# EAGLE design OpenLog (EAGLE 9.1.0)
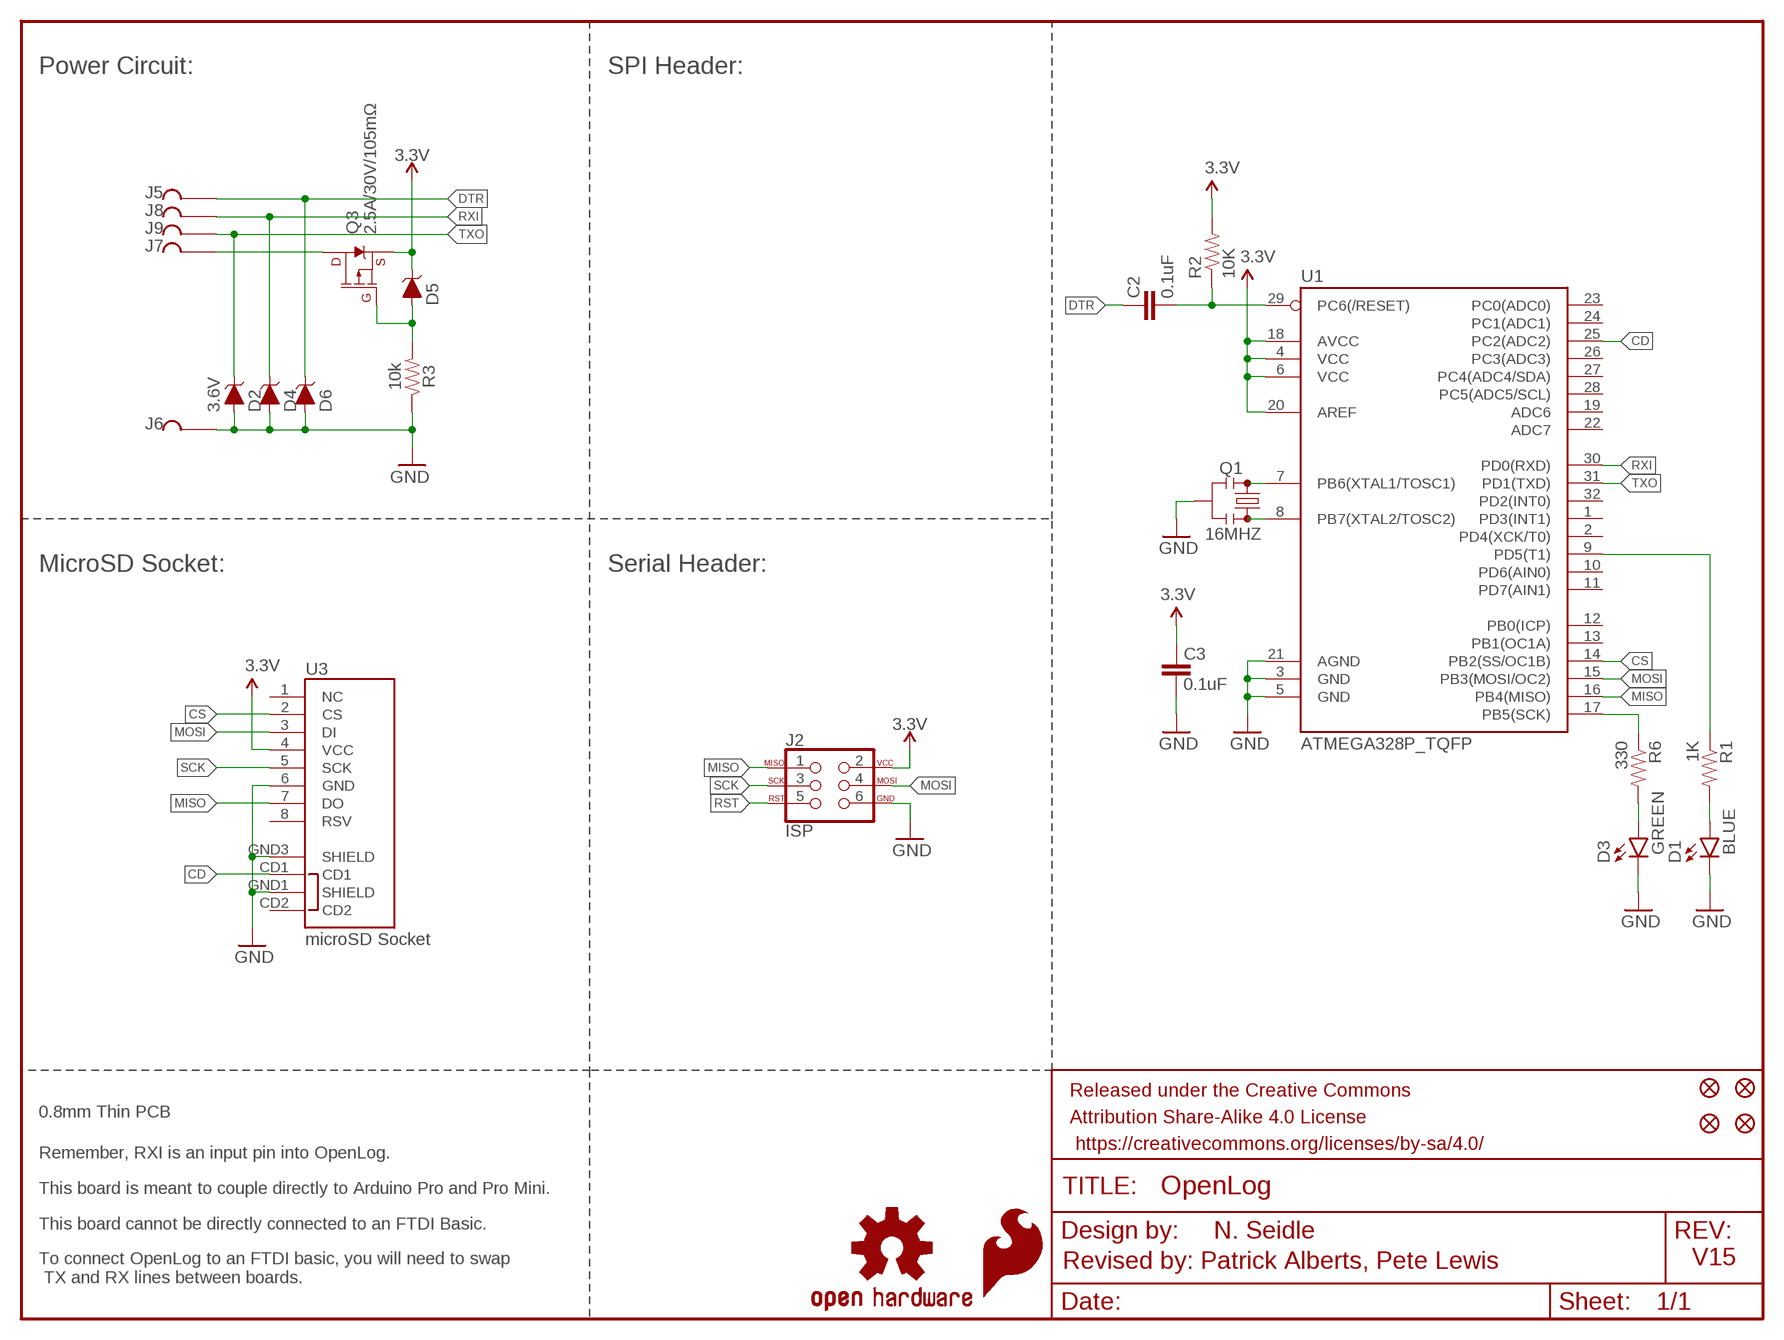
[diagram p0: schematic, sheet 1]

## Parts
C2  0.1uF  0.1UF-25V(+80/-20%)(0603)  [0603-CAP]
C3  0.1uF  0.1UF-25V(+80/-20%)(0603)  [0603-CAP]
D1  BLUE  LED-BLUE0603  [LED-0603]
D2  3.6V  DIODE-ZENER-BZT52C3V6S  [SOD-323]
D3  GREEN  LED-GREEN0603  [LED-0603]
D4  3.6V  DIODE-ZENER-BZT52C3V6S  [SOD-323]
D5  3.6V  DIODE-ZENER-BZT52C3V6S  [SOD-323]
D6  3.6V  DIODE-ZENER-BZT52C3V6S  [SOD-323]
FID1  FIDUCIALUFIDUCIAL  [FIDUCIAL-MICRO]
FID2  FIDUCIALUFIDUCIAL  [FIDUCIAL-MICRO]
FID3  FIDUCIALUFIDUCIAL  [FIDUCIAL-MICRO]
FID4  FIDUCIALUFIDUCIAL  [FIDUCIAL-MICRO]
FRAME1  FRAME-LETTER  [CREATIVE_COMMONS]
J2  ISP  AVR_SPI_PROG_3X2TESTPOINTS  [2X3_TEST_POINTS]
J5  GATORGATOR_MINI  [GATOR_MINI]
J6  GATORGATOR_MINI  [GATOR_MINI]
J7  GATORGATOR_MINI  [GATOR_MINI]
J8  GATORGATOR_MINI  [GATOR_MINI]
J9  GATORGATOR_MINI  [GATOR_MINI]
LOGO1  SFE_LOGO_FLAME.1_INCH  [SFE_LOGO_FLAME_.1]
LOGO2  OSHW-LOGOMINI  [OSHW-LOGO-MINI]
Q1  16MHZ  RESONATOR16MHZ  [RESONATOR-SMD]
Q3  2.5A/30V/105mΩ  MOSFET_PCH-DMG2307L  [SOT23-3]
R1  1K  1KOHM-1/10W-1%(0603)  [0603-RES]
R2  10K  10KOHM-1/10W-1%(0603)0603  [0603-RES]
R3  10k  10KOHM-0603-1/10W-1%  [0603]
R6  330  330OHM1/10W1%(0603)  [0603-RES]
U1  ATMEGA328P_TQFP  [TQFP32-08]
U3  microSD Socket  USD-SOCKET  [MICROSD_1:1]

## Nets
3.3V: C3.2 D5.C J2.2 Q3.2(S) R2.2 U1.4(VCC) U1.6(VCC) U1.18(AVCC) U1.20(AREF) U3.4(VCC)
CD: U1.25(PC2(ADC2)) U3.CD1
CS: U1.14(PB2(SS/OC1B)) U3.2(CS)
DTR: C2.2 D6.C J5.P$2
GND [vcc]: C3.1 D1.C D2.A D3.C D4.A D6.A J2.6 J6.P$2 Q1.2 R3.1 U1.3(GND) U1.5(GND) U1.21(AGND) U3.6(GND) U3.GND1(SHIELD) U3.GND3(SHIELD)
MISO: J2.1 U1.16(PB4(MISO)) U3.7(DO)
MOSI: J2.4 U1.15(PB3(MOSI/OC2)) U3.3(DI)
N$1: Q1.1 U1.8(PB7(XTAL2/TOSC2))
N$2: Q1.3 U1.7(PB6(XTAL1/TOSC1))
N$3: D1.A R1.2
N$4: R1.1 U1.9(PD5(T1))
N$5 [vcc]: D5.A Q3.1(G) R3.2
N$6: J7.P$2 Q3.3(D)
N$7: D3.A R6.2
RST: C2.1 J2.5 R2.1 U1.29(PC6(/RESET))
RXI: D4.C J8.P$2 U1.30(PD0(RXD))
SCK: J2.3 R6.1 U1.17(PB5(SCK)) U3.5(SCK)
TXO: D2.C J9.P$2 U1.31(PD1(TXD))
Unconnected: U1.1(PD3(INT1)) U1.2(PD4(XCK/T0)) U1.10(PD6(AIN0)) U1.11(PD7(AIN1)) U1.12(PB0(ICP)) U1.13(PB1(OC1A)) U1.19(ADC6) U1.22(ADC7) U1.23(PC0(ADC0)) U1.24(PC1(ADC1)) U1.26(PC3(ADC3)) U1.27(PC4(ADC4/SDA)) U1.28(PC5(ADC5/SCL)) U1.32(PD2(INT0)) U3.1(NC) U3.8(RSV) U3.CD2

## Notes on the sheet
- Power Circuit: | SPI Header:
- MicroSD Socket: | Serial Header:
- 0.8mm Thin PCB
- Remember, RXI is an input pin into OpenLog.
- This board is meant to couple directly to Arduino Pro and Pro Mini.
- This board cannot be directly connected to an FTDI Basic.
- N. Seidle
- Revised by: Patrick Alberts, Pete Lewis | V15
- To connect OpenLog to an FTDI basic, you will need to swap
   TX and RX lines between boards.

## Library data of the parts
C2 C3 = SparkFun-Capacitors:0.1UF-25V(+80/-20%)(0603): CAP-00810 Ceramic Standard decoupling cap; PROD_ID: CAP-00810
D1 = SparkFun-LED:LED-BLUE: Blue SMD LED Used in manufacturing of various products at SparkFun Packages: 0603 - SMD 0603 package [Product Link] <http://www.digikey.com/product-detail/en/SMLE12BC7TT86/511-1589-2-ND/1641808> 1206 - SMD1206 package [Product Link] <http://www.digikey.com/product-detail/en/lite-on-inc/LTST-C150TBKT/160-1643-1-ND/573584> SparkFun Products: ESP8266 Thing-Dev Board <https://www.sparkfun.com/products/13711> RedBoard <https://www.sparkfun.com/products/12757>; PROD_ID: DIO-08575
D2 D4-D6 = SparkFun-DiscreteSemi:DIODE-ZENER: Zener Diode A Zener diode allows current to flow from its anode to its cathode like a normal semiconductor diode, but it also permits current to flow in the reverse direction when its "Zener voltage" is reached. - WIkipedia; PROD_ID: DIO-08199
D3 = SparkFun-LED:LED-GREEN: Green SMD LED Used in manufacturing of various products at SparkFun Packages: 0603 - SMD 0603 package [Product Link] <http://www.futureelectronics.com/en/technologies/semiconductors/optoelectronics/leds/Pages/9894312-LTST-C190GKT.aspx?CrossPart=HSMG-C190&IM=0> LilyPad 1206 - SMD1206 LilyPad package [Product Link] <http://www.futureelectronics.com/en/Technologies/Product.aspx?ProductID=IN150NGHARVATEKCORPORATION2049943&IM=0> 1206 - SMD1206 package [Product Link] <http://www.futureelectronics.com/en/technologies/semiconductors/optoelectronics/leds/Pages/8315665-LTST-C150KGKT.aspx?IM=0> 1206 Bottom Mount -SMD 1206 Bottom Mount [Product Link] <http://www.digikey.com/product-detail/en/lite-on-inc/LTST-C230KGKT/160-1456-1-ND/386854> SparkFun Products: Pro Mini 328 -5V <https://www.sparkfun.com/products/821> RedBoard <https://www.sparkfun.com/products/12757> MP3 Trigger <https://www.sparkfun.com/products/13720> Makey Makey <https://www.sparkfun.com/products/11076>; PROD_ID: DIO-00821
FID1-FID4 = SparkFun-Aesthetics:FIDUCIAL: Fiducial Alignment Points Point-of-reference for pick-and-place machines and other optical instruments.
FRAME1 = SparkFun-Aesthetics:FRAME-LETTER: Schematic Frame - Letter Standard 8.5x11 US Letter frame
J2 = SparkFun-Connectors:AVR_SPI_PROG_3X2: AVR ISP 6 Pin This is the reduced ISP connector for AVR programming. Common on Arduino. This footprint will take up less PCB space and can be used with a 10-pin to 6-pin adapter such as SKU: BOB-08508 **Special note about "TEST_POINT" package. The stop mask is on the top side, so if you want your programming test points to be on the bottom of your board, make sure to place this package on the bottom side of the board. This also ensure that the orientation to program from the bottom side will be correct. SparkFun Products: SparkFun ISP Pogo Adapter <https://www.sparkfun.com/products/11591> - NS Tiny AVR Programmer <https://www.sparkfun.com/products/11801> -PTH
J5-J9 = SparkFun-Connectors:GATOR
LOGO1 = SparkFun-Aesthetics:SFE_LOGO_FLAME: SparkFun Flame Logo This is the SparkFun flame logo. The logo on the schematic will always be the same size; the package variant is the height of the flame. Default layer for the logo on the board is tSilk.
LOGO2 = SparkFun-Aesthetics:OSHW-LOGO: Open-Source Hardware (OSHW) Logo This logo indicates the piece of hardware it is found on incorporates a OSHW license and/or adheres to the definition of open source hardware found here: http://freedomdefined.org/OSHW
Q1 = SparkFun-FreqCtrl:RESONATOR: Resonator Small SMD resonator. Used, eg, on the Arduino Pro/ Pro Mini boards. 8MHz- XTAL-08895 16MHz- XTAL-08900; PROD_ID: XTAL-08900
Q3 = SparkFun-DiscreteSemi:MOSFET_PCH: P-channel MOSFETs Voltage controlled devices that allow control of high current outputs. SparkFun Products: SparkFun ESP32 Thing <https://www.sparkfun.com/products/13907> SparkFun ESP8266 Thing <https://www.sparkfun.com/products/13231> SparkFun Pi Servo HAT V2 <https://www.sparkfun.com/products/15316> DMG2305UX-7 (20V/4.2A/SOT23-3); PROD_ID: TRANS-11308
R1 = SparkFun-Resistors:1KOHM-1/10W-1%(0603): RES-07856; PROD_ID: RES-07856
R2 = SparkFun-Resistors:10KOHM-1/10W-1%(0603): RES-00824; PROD_ID: RES-00824
R3 = SparkFun-Resistors:10KOHM: 10kΩ resistor A resistor is a passive two-terminal electrical component that implements electrical resistance as a circuit element. Resistors act to reduce current flow, and, at the same time, act to lower voltage levels within circuits. - Wikipedia; PROD_ID: RES-00824
R6 = SparkFun-Resistors:330OHM1/10W1%(0603): RES-00818; PROD_ID: RES-00818
U1 = SparkFun-DigitalIC:ATMEGA328P_TQFP; PROD_ID: IC-09069
U3 = SparkFun-Connectors:USD-SOCKET: microSD Socket Push-push type uSD socket. Schematic element and footprint production proven. Spark Fun Electronics SKU : PRT-00127. tDoc lines correctly indicate media card edge positions when inserting (unlocked, locked, depressed). NOTE: CD1 and CD2 are connected internally; PROD_ID: CONN-07820

## Net classes
0 default: width 0.178 mm
1 vcc: width 0.203 mm

## Board
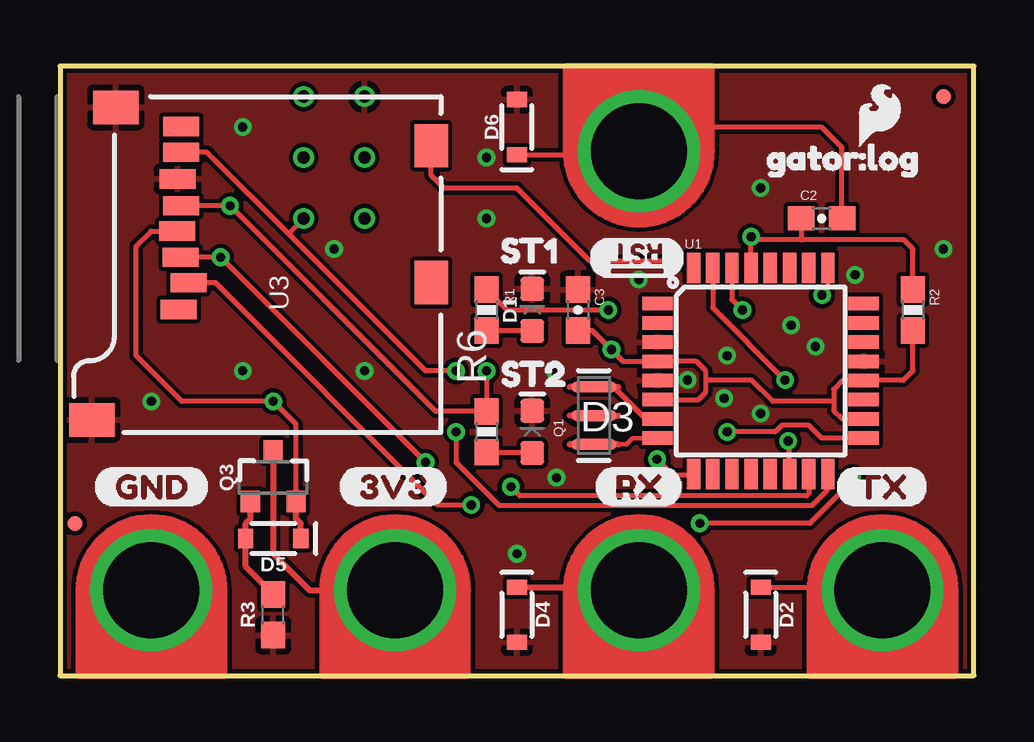
[diagram p1: board, top side]
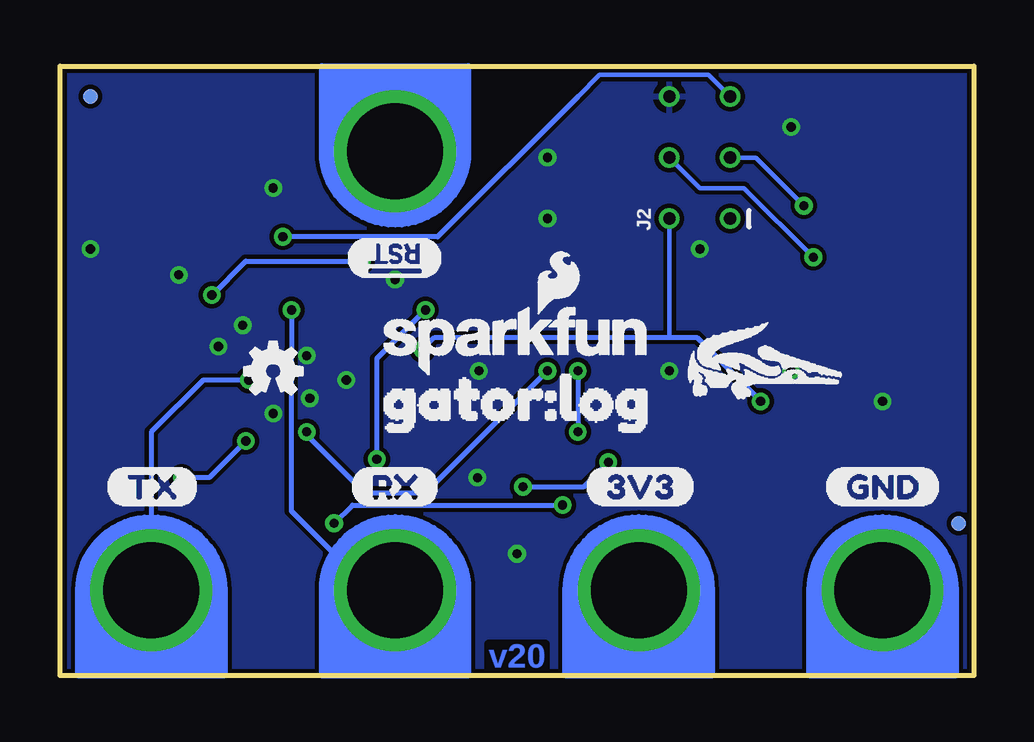
[diagram p2: board, bottom side, seen from below]

Size 38.1 x 25.4 mm. Coordinates in mm from the lower left corner, seen from the top.
Outline: 0,0 38.1,0 38.1,25.4 0,25.4 0,0
Copper layers (1*16): Top 0.035mm / dielectric 1.5mm / Bottom 0.035mm
Design rules "SparkFun-2-layer-TIGHT": minimum track width 7mil, minimum drill 15mil, track to track 7mil, track to pad 7mil, pad to pad 7mil, via to via 7mil, smd to smd 7mil, copper to edge 7mil, drill to drill 7mil, minimum pad ring 7mil, minimum via ring 7mil, stop-mask expansion 4mil, vias tented up to drill 20mil, thermal gap 10mil

### Footprints (pad centres in the part's own frame; a part is rotated, then mirrored left to right if it is on the bottom)
0603-CAP = smd 1.1 x 1: 1 -0.85,0; 2 0.85,0
LED-0603 = smd 1 x 1: A -0.877,0; C 0.877,0
SOD-323 = smd 0.63 x 0.83: A 1.15,0; C -1.15,0
FIDUCIAL-MICRO = smd 0.635 x 0.635: 1 0,0
2X3_TEST_POINTS = drill 0.508: 1 -2.54,-1.27; 2 -2.54,1.27; 3 0,-1.27; 4 0,1.27; 5 2.54,-1.27; 6 2.54,1.27
GATOR_MINI = drill 4 pad 5.08: P$2 0,-0.254
RESONATOR-SMD = smd 0.45 x 1.905: 1 -1.2,0; 2 0,0; 3 1.2,0
SOT23-3 = smd 0.8 x 0.9: 1 -0.95,-1; 2 0.95,-1; 3 0,1.1
0603-RES = smd 1.1 x 1: 1 -0.85,0; 2 0.85,0
0603 = smd 1.1 x 1: 1 -0.85,0; 2 0.85,0
TQFP32-08 = smd 1.27 x 0.559: 1 -4.293,2.8; 2 -4.293,2; 3 -4.293,1.2; 4 -4.293,0.4; 5 -4.293,-0.4; 6 -4.293,-1.2; 7 -4.293,-2; 8 -4.293,-2.8; 17 4.293,-2.8; 18 4.293,-2; 19 4.293,-1.2; 20 4.293,-0.4; 21 4.293,0.4; 22 4.293,1.2; 23 4.293,2; 24 4.293,2.8 | smd 0.559 x 1.27: 9 -2.8,-4.293; 10 -2,-4.293; 11 -1.2,-4.293; 12 -0.4,-4.293; 13 0.4,-4.293; 14 1.2,-4.293; 15 2,-4.293; 16 2.8,-4.293; 25 2.8,4.293; 26 2,4.293; 27 1.2,4.293; 28 0.4,4.293; 29 -0.4,4.293; 30 -1.2,4.293; 31 -2,4.293; 32 -2.8,4.293
MICROSD_1:1 = smd 0.8 x 1.5: 1 5.096,10.919; 2 6.218,10.519; 3 7.274,10.853; 4 8.367,10.982; 5 9.421,10.828; 6 10.539,10.973; 7 11.648,10.819; 8 12.721,10.819 | smd 1.8 x 1.4: CD1 11.92,0.4; CD2 6.22,0.4 | smd 1.4 x 1.9: GND1 0.497,14.55; GND3 13.52,13.55

### Placement (x,y rotation side)
C2  31.75,19.05 0 top
C3  21.59,15.24 270 top
D1  19.68,15.24 90 top
D2  29.21,2.54 270 top
D3  19.68,10.16 90 top
D4  19.05,2.54 270 top
D5  8.89,5.71 180 top
D6  19.05,22.86 90 top
FID1  0.64,6.35 180 top
FID2  36.83,24.13 0 top
FID3  0.64,6.35 270 bottom
FID4  36.83,24.13 180 bottom
FRAME1  -21.06,-15.24 0 top  (outside the outline)
J2  11.43,21.59 90 bottom
J5  24.13,21.59 180 top
J6  3.81,3.81 0 top
J7  13.97,3.81 0 top
J8  24.13,3.81 0 top
J9  34.29,3.81 0 top
LOGO1  34.16,23.37 0 top
LOGO2  29.21,12.7 0 bottom
Q1  22.26,10.84 90 top
Q3  8.89,8.26 0 top
R1  17.78,15.24 270 top
R2  35.56,15.24 270 top
R3  8.89,2.54 90 top
R6  17.78,10.16 270 top
U1  29.21,12.7 0 top
U3  15.88,10.16 90 top
U$1  [#RST4]  26.23,17.4 180 top
U$2  [#RST4]  21.97,17.4 180 bottom
U$3  [3V32]  11.56,7.87 0 top
U$4  [3V32]  16.26,7.87 0 bottom
U$5  [GND3]  1.4,7.87 0 top
U$6  [GND3]  6.22,7.87 0 bottom
U$7  [RX0]  22.23,7.87 0 top
U$8  [RX0]  26.04,7.87 0 bottom
U$9  [TX1]  32.32,7.87 0 top
U$10  [TX1]  36.2,7.87 0 bottom
U$11  [GATOR#LOG6]  28.51,21.59 0 top
U$12  [GATOR#LOG5]  26.29,11.56 0 bottom
U$13  [SFE_LOGO_NAME_FLAME_.1]  19.05,13.97 0 bottom
U$14  [ST16]  17.46,17.72 0 top
U$15  [ST27]  17.46,12.57 0 top
U$16  [GATORBIT_FINAL_FOR_SILK#01_#1##JPG]  8.7,13.14 0 bottom

### Tracks (layer width: path | path; a pad name or v marks a point on that pad's centre or on a via)
3.3V  (via drill 0.38)
  Top 0.203: U1.6 26.61,11.5 26.92,11.81 26.92,12.19 26.92,12.32 | 32.26,11.43 32.26,11.94 32.62,12.3 U1.20 35.16,12.3 35.56,12.7 R2.2 | 32.26,11.43 32.26,11.05 32.61,10.7 U1.18 | 32.26,11.43 29.72,11.43 28.83,12.32 26.92,12.32 | 26.92,12.32 26.92,12.7 26.52,13.1 U1.4 23.48,13.1 v22.99,13.59 22.19,14.39 C3.2 | Q3.2 9.84,10.48 v8.89,11.43 5.08,11.43 3.17,13.34 3.17,17.91 3.79,18.53 U3.4
  Top 0.254: D5.C 10.04,6.34 9.84,6.54 Q3.2
  Bottom 0.178: J2.2 12.7,14.1
  Bottom 0.203: v8.89,11.43 11.56,14.1 12.7,14.1 22.48,14.1 v22.99,13.59
CD  (via drill 0.38)
  Top 0.203: U1.25 32.01,16.11 v31.77,15.86 | v25.53,17.27 22.1,17.27 19.05,20.32 16,20.32 15.47,20.85 U3.CD1
  Bottom 0.203: v25.53,17.27 30.35,17.27 v31.77,15.86
CS  (via drill 0.38)
  Top 0.203: U1.14 30.41,9.72 v30.35,9.78 | v33.02,8.26 32.57,7.8 32.57,7.66 31.26,6.35 v26.67,6.35 | v17.14,7.11 15.75,7.11 6.48,16.38 U3.2
  Bottom 0.203: v30.35,9.78 31.88,8.26 v33.02,8.26 | v26.67,6.35 25.91,7.11 v17.14,7.11
DTR
  Top 0.203: D6.C 24,21.71 24,21.72 | 24,21.72 J5.P$2 | 32.6,19.47 C2.2 32.6,22.01 31.75,22.86 25.15,22.86 24,21.72 | 24.13,21.59 24,21.72
GND  (via drill 0.38)
  other vias: 20.64,12.7 24.13,16.51 26.16,12.32 31.5,13.72 30.48,14.61 27.81,13.34 27.69,11.56 29.21,10.92 29.21,20.32 36.83,17.78 33.15,16.7 17.78,21.59 17.78,19.05 20.7,8.26 19.05,5.08 12.7,12.7 7.62,12.7 7.62,22.86 11.43,17.78 3.81,11.43
  pour Top: 0,25.4 38.1,25.4 38.1,0 0,0
  pour Bottom: 38.1,25.4 0,25.4 0,0 38.1,0
MISO  (via drill 0.38)
  Top 0.178: J2.1 9.53,18.41
  Top 0.203: v16.51,10.16 16.51,8.89 18.3,7.1 31.36,7.1 32.01,7.75 U1.16 | v16.51,12.7 15.24,12.7 12.06,15.88 9.53,18.41 6.35,21.59 | 6.35,21.59 6.13,21.81 | 6.35,21.59 6.13,21.81 | 6.13,21.81 U3.7
  Bottom 0.203: v16.51,12.7 v16.51,10.16
MOSI  (via drill 0.38)
  Top 0.203: U3.3 5.08,17.43 | 5.08,17.43 5.43,17.43 | U1.15 31.21,7.59 31.11,7.49 19.18,7.49 v18.8,7.87 | v15.24,8.89 v6.7,17.43 5.08,17.43
  Bottom 0.178: v6.7,17.43 9.58,20.32 11.43,20.32 J2.4
  Bottom 0.203: v18.8,7.87 16.26,7.87 v15.24,8.89
N$1
  Top 0.178: Q1.1 23.61,9.64 23.87,9.9 U1.8
  Top 0.203: 24.5,9.9 U1.8
N$2
  Top 0.203: U1.7 24.41,10.7 23.07,12.04 Q1.3
N$3
  Top 0.203: D1.A 17.81,14.36 R1.2
N$4  (via drill 0.38)
  Top 0.203: R1.1 18.63,15.24 v22.86,15.24 | U1.9 26.41,8.38 25.53,8.38 v24.89,9.02
  Bottom 0.203: v24.89,9.02 24.89,13.21 v22.86,15.24
N$5
  Top 0.254: R3.2 7.74,4.54 D5.A 7.74,6.34 7.94,6.54 Q3.1
N$6
  Top 0.254: Q3.3 8.89,5.08 10.41,3.56 J7.P$2
N$7
  Top 0.203: D3.A 17.81,9.28 R6.2
RST  (via drill 0.38)
  Top 0.203: U1.29 v28.81,18.29 28.94,18.16 30.92,18.16 | R2.1 35.56,17.78 35.18,18.16 30.92,18.16 | C2.1 30.9,18.19 30.92,18.16
  Bottom 0.178: 16.51,24.13 15.61,25.03 11.06,25.03 J2.5
  Bottom 0.203: v28.81,18.29 22.35,18.29 16.51,24.13
RXI  (via drill 0.38)
  Top 0.203: v28.45,15.24 28.01,15.68 U1.30
  Top 0.254: D4.C 24,3.69 J8.P$2
  Bottom 0.203: v28.45,15.24 28.45,13.62 28.46,13.6 28.46,6.87 26.23,4.64 26.23,2.94 26.07,2.77 24.29,2.77 24.13,2.94 J8.P$2
SCK  (via drill 0.38)
  Top 0.203: U3.5 v7.09,19.58 15.66,11.01 R6.1 v17.78,12.7 | U1.17 31.75,9.9 | 31.75,9.9 | 31.75,9.9 31.62,10.03 | 31.62,10.03 31.5,10.15 | 31.62,10.03 31.22,10.43 30.09,10.43 29.82,10.16 v27.81,10.16
  Bottom 0.178: v7.09,19.58 9.1,21.59 J2.3
  Bottom 0.203: v27.81,10.16 27.81,10.03 25.4,7.62 22.86,7.62 v17.78,12.7
TXO  (via drill 0.38)
  Top 0.203: D2.C 34.16,3.69 J9.P$2 | U1.31 27.21,15.34 v30.23,12.32
  Bottom 0.203: v30.23,12.32 32.13,12.32 34.29,10.16 J9.P$2

### Text on the board
Bottom: v20
tDocu: N. Seidle | Revised by: Patrick Alberts, Pete Lewis